# Altium schematic sheet SH6 - SCIENCECONTROLS.SchDoc
size Letter; Organization: UW Robotics; Address1: 200 University Avenue; Address2: Waterloo; Address3: Ontario; Address4: Canada N2L 3G6
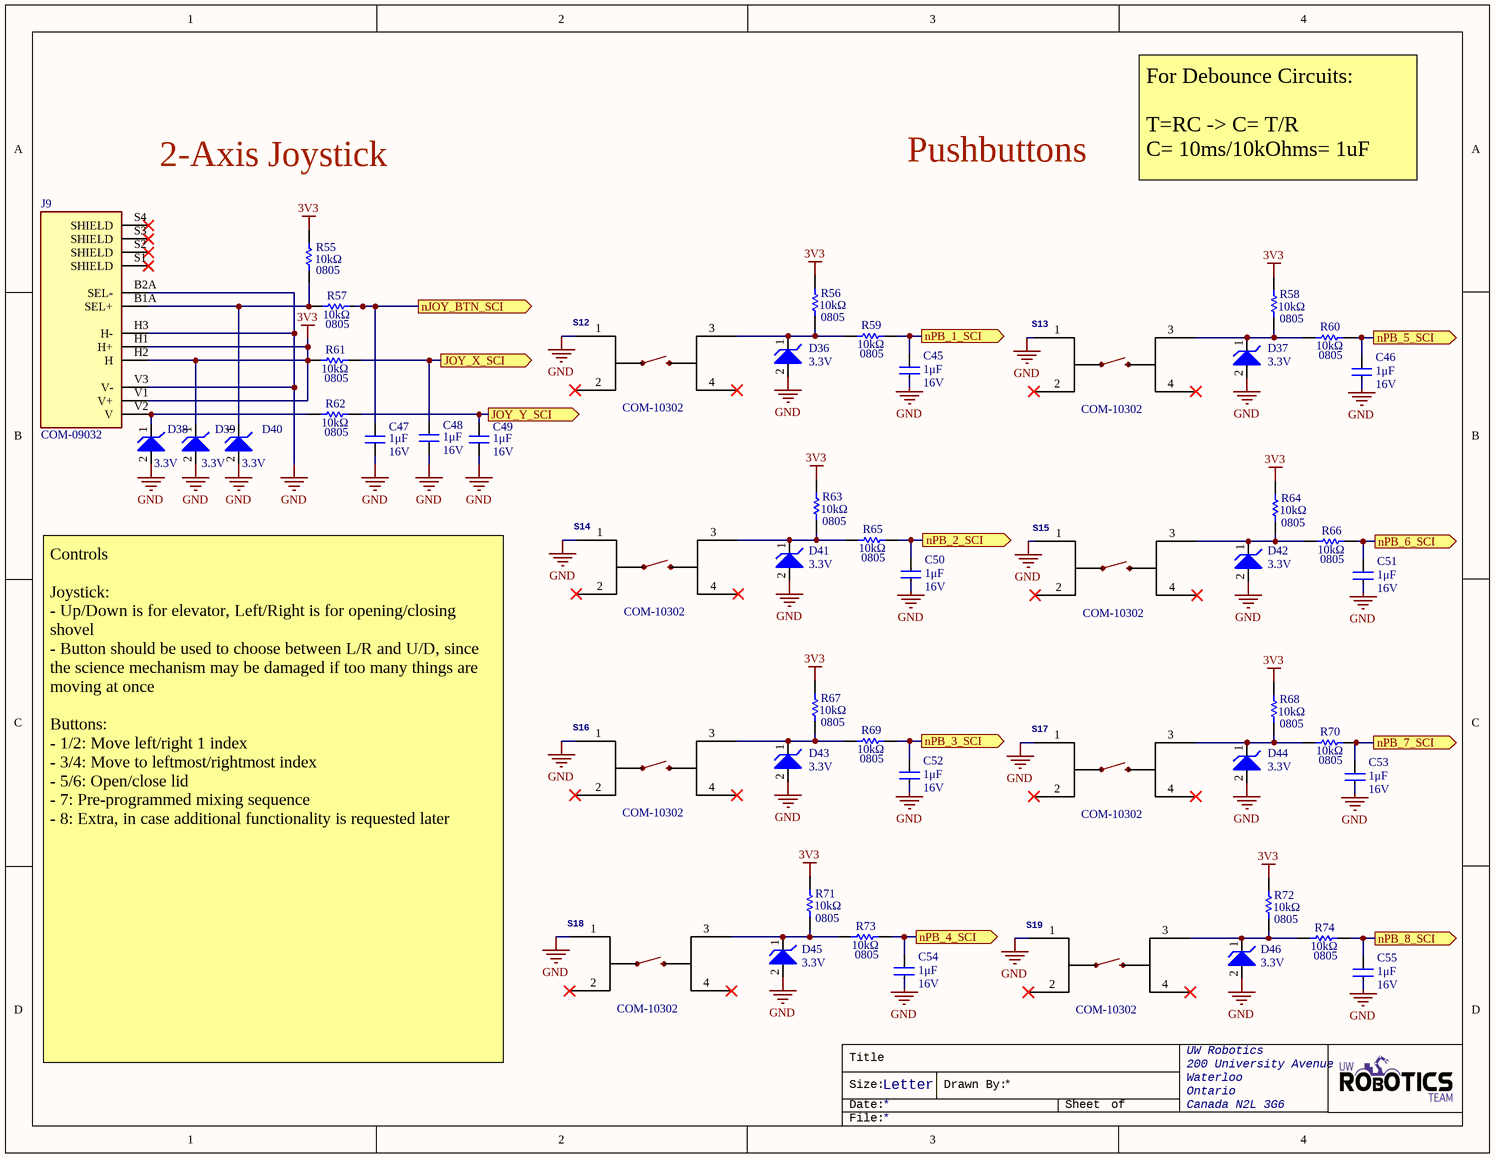
[diagram p0: SH6 - SCIENCECONTROLS.SchDoc]

## Parts
C45  value 1μF  Voltage Rating: 16V  [CAP2012]  (hidden comment: CAP_1uF_16V_0805)
C46  value 1μF  Voltage Rating: 16V  [CAP2012]  (hidden comment: CAP_1uF_16V_0805)
C47  value 1μF  Voltage Rating: 16V  [CAP2012]  (hidden comment: CAP_1uF_16V_0805)
C48  value 1μF  Voltage Rating: 16V  [CAP2012]  (hidden comment: CAP_1uF_16V_0805)
C49  value 1μF  Voltage Rating: 16V  [CAP2012]  (hidden comment: CAP_1uF_16V_0805)
C50  value 1μF  Voltage Rating: 16V  [CAP2012]  (hidden comment: CAP_1uF_16V_0805)
C51  value 1μF  Voltage Rating: 16V  [CAP2012]  (hidden comment: CAP_1uF_16V_0805)
C52  value 1μF  Voltage Rating: 16V  [CAP2012]  (hidden comment: CAP_1uF_16V_0805)
C53  value 1μF  Voltage Rating: 16V  [CAP2012]  (hidden comment: CAP_1uF_16V_0805)
C54  value 1μF  Voltage Rating: 16V  [CAP2012]  (hidden comment: CAP_1uF_16V_0805)
C55  value 1μF  Voltage Rating: 16V  [CAP2012]  (hidden comment: CAP_1uF_16V_0805)
D36  Reverse Standoff Voltage: 3.3V  [SOD523]  (hidden comment: TVS_DIODE_UNIDIR_3.3V)
D37  Reverse Standoff Voltage: 3.3V  [SOD523]  (hidden comment: TVS_DIODE_UNIDIR_3.3V)
D38  Reverse Standoff Voltage: 3.3V  [SOD523]  (hidden comment: TVS_DIODE_UNIDIR_3.3V)
D39  Reverse Standoff Voltage: 3.3V  [SOD523]  (hidden comment: TVS_DIODE_UNIDIR_3.3V)
D40  Reverse Standoff Voltage: 3.3V  [SOD523]  (hidden comment: TVS_DIODE_UNIDIR_3.3V)
D41  Reverse Standoff Voltage: 3.3V  [SOD523]  (hidden comment: TVS_DIODE_UNIDIR_3.3V)
D42  Reverse Standoff Voltage: 3.3V  [SOD523]  (hidden comment: TVS_DIODE_UNIDIR_3.3V)
D43  Reverse Standoff Voltage: 3.3V  [SOD523]  (hidden comment: TVS_DIODE_UNIDIR_3.3V)
D44  Reverse Standoff Voltage: 3.3V  [SOD523]  (hidden comment: TVS_DIODE_UNIDIR_3.3V)
D45  Reverse Standoff Voltage: 3.3V  [SOD523]  (hidden comment: TVS_DIODE_UNIDIR_3.3V)
D46  Reverse Standoff Voltage: 3.3V  [SOD523]  (hidden comment: TVS_DIODE_UNIDIR_3.3V)
J9  Manufacturer Part Number 1: COM-09032  [2_AXIS_JOYSTICK]  (hidden comment: 2_AXIS_JOYSTICK)
R55  value 10kΩ  Case Code (Imperial): 0805  [RESC0805]  (hidden comment: RES_10kΩ_0805_5%)
R56  value 10kΩ  Case Code (Imperial): 0805  [RESC0805]  (hidden comment: RES_10kΩ_0805_5%)
R57  value 10kΩ  Case Code (Imperial): 0805  [RESC0805]  (hidden comment: RES_10kΩ_0805_5%)
R58  value 10kΩ  Case Code (Imperial): 0805  [RESC0805]  (hidden comment: RES_10kΩ_0805_5%)
R59  value 10kΩ  Case Code (Imperial): 0805  [RESC0805]  (hidden comment: RES_10kΩ_0805_5%)
R60  value 10kΩ  Case Code (Imperial): 0805  [RESC0805]  (hidden comment: RES_10kΩ_0805_5%)
R61  value 10kΩ  Case Code (Imperial): 0805  [RESC0805]  (hidden comment: RES_10kΩ_0805_5%)
R62  value 10kΩ  Case Code (Imperial): 0805  [RESC0805]  (hidden comment: RES_10kΩ_0805_5%)
R63  value 10kΩ  Case Code (Imperial): 0805  [RESC0805]  (hidden comment: RES_10kΩ_0805_5%)
R64  value 10kΩ  Case Code (Imperial): 0805  [RESC0805]  (hidden comment: RES_10kΩ_0805_5%)
R65  value 10kΩ  Case Code (Imperial): 0805  [RESC0805]  (hidden comment: RES_10kΩ_0805_5%)
R66  value 10kΩ  Case Code (Imperial): 0805  [RESC0805]  (hidden comment: RES_10kΩ_0805_5%)
R67  value 10kΩ  Case Code (Imperial): 0805  [RESC0805]  (hidden comment: RES_10kΩ_0805_5%)
R68  value 10kΩ  Case Code (Imperial): 0805  [RESC0805]  (hidden comment: RES_10kΩ_0805_5%)
R69  value 10kΩ  Case Code (Imperial): 0805  [RESC0805]  (hidden comment: RES_10kΩ_0805_5%)
R70  value 10kΩ  Case Code (Imperial): 0805  [RESC0805]  (hidden comment: RES_10kΩ_0805_5%)
R71  value 10kΩ  Case Code (Imperial): 0805  [RESC0805]  (hidden comment: RES_10kΩ_0805_5%)
R72  value 10kΩ  Case Code (Imperial): 0805  [RESC0805]  (hidden comment: RES_10kΩ_0805_5%)
R73  value 10kΩ  Case Code (Imperial): 0805  [RESC0805]  (hidden comment: RES_10kΩ_0805_5%)
R74  value 10kΩ  Case Code (Imperial): 0805  [RESC0805]  (hidden comment: RES_10kΩ_0805_5%)
S12  Manufacturer Part Number 1: COM-10302  [TACTILE_SWITCH_PTH_12MM]  (hidden comment: Pushbutton)
S13  Manufacturer Part Number 1: COM-10302  [TACTILE_SWITCH_PTH_12MM]  (hidden comment: Pushbutton)
S14  Manufacturer Part Number 1: COM-10302  [TACTILE_SWITCH_PTH_12MM]  (hidden comment: Pushbutton)
S15  Manufacturer Part Number 1: COM-10302  [TACTILE_SWITCH_PTH_12MM]  (hidden comment: Pushbutton)
S16  Manufacturer Part Number 1: COM-10302  [TACTILE_SWITCH_PTH_12MM]  (hidden comment: Pushbutton)
S17  Manufacturer Part Number 1: COM-10302  [TACTILE_SWITCH_PTH_12MM]  (hidden comment: Pushbutton)
S18  Manufacturer Part Number 1: COM-10302  [TACTILE_SWITCH_PTH_12MM]  (hidden comment: Pushbutton)
S19  Manufacturer Part Number 1: COM-10302  [TACTILE_SWITCH_PTH_12MM]  (hidden comment: Pushbutton)

## Ports
JOY_X_SCI (out), JOY_Y_SCI (out), nJOY_BTN_SCI (out), nPB_1_SCI (out), nPB_2_SCI (out), nPB_3_SCI (out), nPB_4_SCI (out), nPB_5_SCI (out), nPB_6_SCI (out), nPB_7_SCI (out), nPB_8_SCI (out)

## Nets
3V3: D39.1 J9.H1(H+) J9.H2(H) J9.V1(V+) R55.1 R56.1 R58.1 R61.1 R63.1 R64.1 R67.1 R68.1 R71.1 R72.1
GND: C45.1 C46.1 C47.1 C48.1 C49.1 C50.1 C51.1 C52.1 C53.1 C54.1 C55.1 D36.2 D37.2 D38.2 D39.2 D40.2 D41.2 D42.2 D43.2 D44.2 D45.2 D46.2 J9.B2A(SEL-) J9.H3(H-) J9.V3(V-) S12.1 S13.1 S14.1 S15.1 S16.1 S17.1 S18.1 S19.1
JOY_X_SCI: C48.2 R61.2 ; port JOY_X_SCI
JOY_Y_SCI: C49.2 R62.2 ; port JOY_Y_SCI
nJOY_BTN_SCI: C47.2 R57.2 ; port nJOY_BTN_SCI
nPB_1_SCI: C45.2 R59.2 ; port nPB_1_SCI
nPB_2_SCI: C50.2 R65.2 ; port nPB_2_SCI
nPB_3_SCI: C52.2 R69.2 ; port nPB_3_SCI
nPB_4_SCI: C54.2 R73.2 ; port nPB_4_SCI
nPB_5_SCI: C46.2 R60.2 ; port nPB_5_SCI
nPB_6_SCI: C51.2 R66.2 ; port nPB_6_SCI
nPB_7_SCI: C53.2 R70.2 ; port nPB_7_SCI
nPB_8_SCI: C55.2 R74.2 ; port nPB_8_SCI
NetD36_1: D36.1 R56.2 R59.1 S12.3
NetD37_1: D37.1 R58.2 R60.1 S13.3
NetD38_1: D38.1 J9.V2(V) R62.1
NetD40_1: D40.1 J9.B1A(SEL+) R55.2 R57.1
NetD41_1: D41.1 R63.2 R65.1 S14.3
NetD42_1: D42.1 R64.2 R66.1 S15.3
NetD43_1: D43.1 R67.2 R69.1 S16.3
NetD44_1: D44.1 R68.2 R70.1 S17.3
NetD45_1: D45.1 R71.2 R73.1 S18.3
NetD46_1: D46.1 R72.2 R74.1 S19.3

Not connected (* = marked no-connect by the designer): J9 S1(SHIELD)* S2(SHIELD)* S3(SHIELD)* S4(SHIELD)*; S12 2* 4*; S13 2* 4*; S14 2* 4*; S15 2* 4*; S16 2* 4*; S17 2* 4*; S18 2* 4*; S19 2* 4*

## Notes on the sheet
- Pushbuttons
- 2-Axis Joystick
- For Debounce Circuits:
  T=RC -> C= T/R
  C= 10ms/10kOhms= 1uF
- Controls
  Joystick:
  - Up/Down is for elevator, Left/Right is for opening/closing shovel
  - Button should be used to choose between L/R and U/D, since the science mechanism may be damaged if too many things are moving at once
  Buttons:
  - 1/2: Move left/right 1 index
  - 3/4: Move to leftmost/rightmost index
  - 5/6: Open/close lid
  - 7: Pre-programmed mixing sequence
  - 8: Extra, in case additional functionality is requested later
- Title
- Size:
- Date:
- Letter
- Drawn By:
- Sheet
- of
- File:

## Library data of the parts
C45-C55 = CAP_1uF_16V_0805: CAP CER 1UF 16V X7R 0805; Manufacturer 1: Yageo; Manufacturer Part Number 1: CC0805KKX7R7BB105; Tolerance: 10%; Mount: Surface Mount; Case Code (Metric): 2012; Case Code (Imperial): 0805; Min Operating Temperature: -55°C; Max Operating Temperature: 125°C; Dielectric: X7R; Termination: SMD/SMT; Supplier 1: Digi-Key; Supplier Part Number 1: 311-1365-1-ND; Package: 0805 (2012 Metric)
D36-D46 = TVS_DIODE_UNIDIR_3.3V: TVS DIODE 3.3V 14.1V SOD523. Used to protect each connector input line going into the MCU.; Manufacturer 1: ON Semiconductor; Manufacturer Part Number 1: ESD5Z3.3T1G; Reverse Breakdown Voltage: 5V; Peak Pulse Power: 158W; Power Line Protection: No; Number of Channels: 1; Polarity: Unidirectional; Peak Pulse Current: 11.2A; Supplier 1: Digi-Key; Mount: Surface Mount; Number of Pins: 2; Min Operating Temperature: -55°C; Max Operating Temperature: 150°C; Clamping Voltage: 14.1V; Composition: Zener; Supplier Part Number 1: ESD5Z3.3T1GOSCT-ND
J9 = 2_AXIS_JOYSTICK: JOYSTICK 10K OHM 2 AXIS TH; Manufacturer 1: SparkFun; Supplier 1: Digi-Key; Supplier Part Number 1: 1568-1526-ND
R55-R74 = RES_10kΩ_0805_5%: RES 10K OHM 5% 1/8W 0805; Manufacturer 1: Panasonic Electronic Components; Manufacturer Part Number 1: ERJ-6GEYJ103V; Supplier 1: Digi-Key; Supplier Part Number 1: P10KACT-ND
S12-S19 = MOMENTARY_SWITCH_TH: TACTILE MOMENTARY PUSHBUTTON SPST; Manufacturer 1: SparkFun; SymbolName_1: SWITCH-MOMENTARY-2; PROD_ID: SWCH-09185; SF_SKU: COM-09190; Package: TACTILE_SWITCH_PTH_12MM; Supplier 1: Digi-Key; Mount: Through Hole; Throw Configuration: SPST; Termination: PC Pin; Supplier Part Number 1: 1568-1332-ND